# EAGLE schematic adns-9500 (EAGLE 6.2)
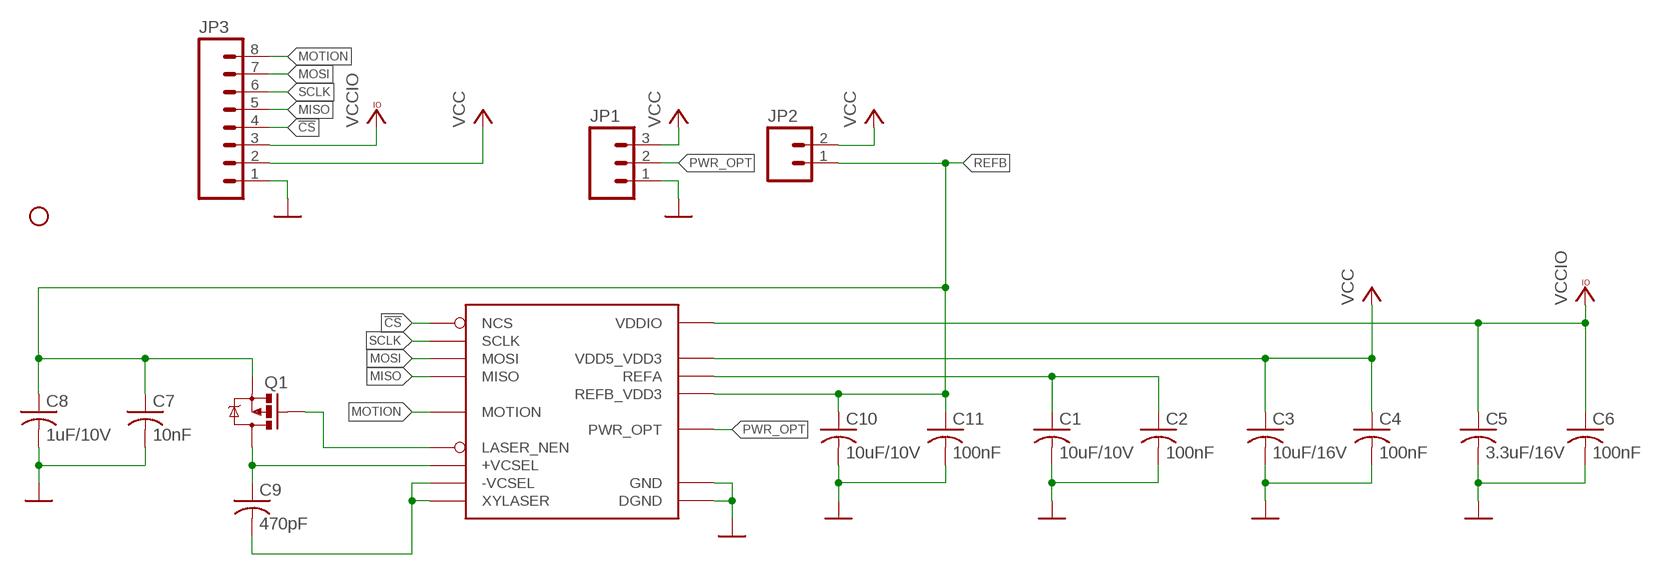
[diagram p0: schematic, sheet 1]

## Parts
C1  10uF/10V  C-USC1206  [C1206]
C2  100nF  C-USC0603  [C0603]
C3  10uF/16V  C-USC1206  [C1206]
C4  100nF  C-USC0603  [C0603]
C5  3.3uF/16V  C-USC1206  [C1206]
C6  100nF  C-USC0603  [C0603]
C7  10nF  C-USC0603  [C0603]
C8  1uF/10V  C-USC0603  [C0603]
C9  470pF  C-USC0603  [C0603]
C10  10uF/10V  C-USC1206  [C1206]
C11  100nF  C-USC0603  [C0603]
JP1  M03PTH  [1X03]
JP2  M02PTH  [1X02]
JP3  M081X08  [1X08]
JP4  STAND-OFF  [STAND-OFF]
Q1  MOSFET-PCHANNELSMD  [SOT23-3]
U1  AVAGO-ADNS-9500  [AVAGO-ADNS-9500]

## Nets
!CS: JP3.4 U1.NCS
GND: C1.2 C2.2 C3.2 C4.2 C5.2 C6.2 C7.2 C8.2 C10.2 C11.2 JP1.1 JP3.1 U1.DGND U1.GND
MISO: JP3.5 U1.MISO
MOSI: JP3.7 U1.MOSI
MOTION: JP3.8 U1.MOTION
N$2: C1.1 C2.1 U1.REFA
N$3: C9.2 U1.-VCSEL U1.XYLASER
N$4: Q1.1(G) U1.LASER_NEN
N$5: C9.1 Q1.3(D) U1.+VCSEL
PWR_OPT: JP1.2 U1.PWR_OPT
REFB: C7.1 C8.1 C10.1 C11.1 JP2.1 Q1.2(S) U1.REFB_VDD3
SCLK: JP3.6 U1.SCLK
VCC: C3.1 C4.1 JP1.3 JP2.2 JP3.2 U1.VDD5_VDD3
VCCIO: C5.1 C6.1 JP3.3 U1.VDDIO

## Library data of the parts
C1-C11 = adafruit:C-US: CAPACITOR, American symbol
JP1 = SparkFun:M03: Header 3 Standard 3-pin 0.1" header. Use with straight break away headers (SKU : PRT-00116), right angle break away headers (PRT-00553), swiss pins (PRT-00743), machine pins (PRT-00117), and female headers (PRT-00115). Molex polarized connector foot print use with SKU : PRT-08232 with associated crimp pins and housings.
JP2 = SparkFun:M02: Header 2 Standard 2-pin 0.1" header. Use with straight break away headers (SKU : PRT-00116), right angle break away headers (PRT-00553), swiss pins (PRT-00743), machine pins (PRT-00117), and female headers (PRT-00115). Molex polarized connector foot print use with SKU : PRT-08233 with associated crimp pins and housings.
JP3 = SparkFun:M08: Header 8 Standard 8-pin 0.1" header. Use with straight break away headers (SKU : PRT-00116), right angle break away headers (PRT-00553), swiss pins (PRT-00743), machine pins (PRT-00117), and female headers (PRT-00115).
JP4 = SparkFun:STAND-OFF: Stand Off This is the mechanical footprint for a #4 phillips button head screw. Use the keepout ring to avoid running the screw head into surrounding components. SKU : PRT-00447
Q1 = SparkFun:MOSFET-PCHANNEL
U1 = adns-9500:AVAGO-ADNS-9500